# Altium schematic sheet var_02_scheme.SchDoc
size A4; SheetNumber: 2; SheetTotal: 10
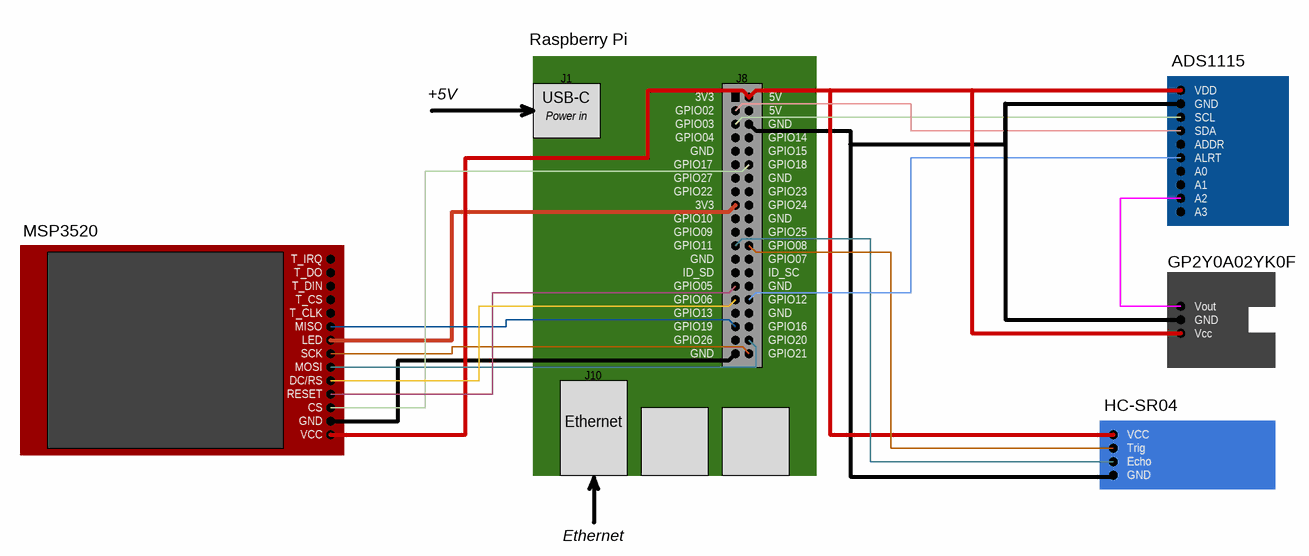
[diagram p0: var_02_scheme.SchDoc]

## Notes on the sheet
- +5V
- Raspberry Pi
- USB-C
- J1
- 3V3
- J8
- 5V
- ADS1115
- VDD
- GND
- Power in
- GPIO17
- GPIO02
- GPIO03
- GPIO04
- GPIO14
- GPIO15
- GPIO18
- SCL
- SDA
- ADDR
- ALRT
- MSP3520
- GPIO27
- GPIO22
- GPIO09
- GPIO10
- GPIO23
- GPIO24
- GPIO25
- A0
- A1
- A2
- A3
- T_IRQ
- T_DO
- T_DIN
- T_CS
- GPIO11
- GPIO05
- GPIO06
- ID_SD
- GPIO08
- GPIO07
- ID_SC
- GPIO12
- GP2Y0A02YK0F
- T_CLK
- MOSI
- SCK
- LED
- MISO
- J10
- GPIO13
- GPIO19
- GPIO26
- GPIO16
- GPIO20
- GPIO21
- Vout
- Vcc
- VCC
- CS
- RESET
- DC/RS
- Ethernet
- HC-SR04
- Trig
- Echo